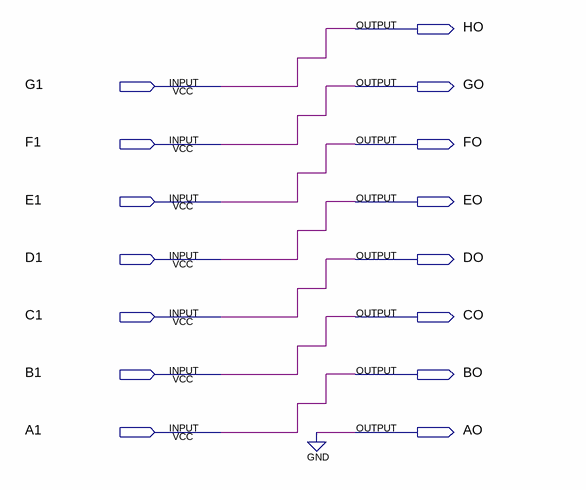
[diagram p0: schematic sheet]
// Quartus schematic ShiftRight.bdf as structural Verilog: 0 symbols, 15 pins
module ShiftRight (
  input  G1,
  input  F1,
  input  E1,
  input  D1,
  input  C1,
  input  B1,
  input  A1,
  output HO,
  output GO,
  output FO,
  output EO,
  output DO,
  output CO,
  output BO,
  output AO
);


  assign AO = 1'b0;
  assign BO = A1;
  assign CO = B1;
  assign DO = C1;
  assign EO = D1;
  assign FO = E1;
  assign GO = F1;
  assign HO = G1;
endmodule
